# Altium schematic sheet ReboostV2_Phase.SchDoc: Power Electronics
size 420 x 297 mm; DocumentNumber: 2; SheetNumber: 2
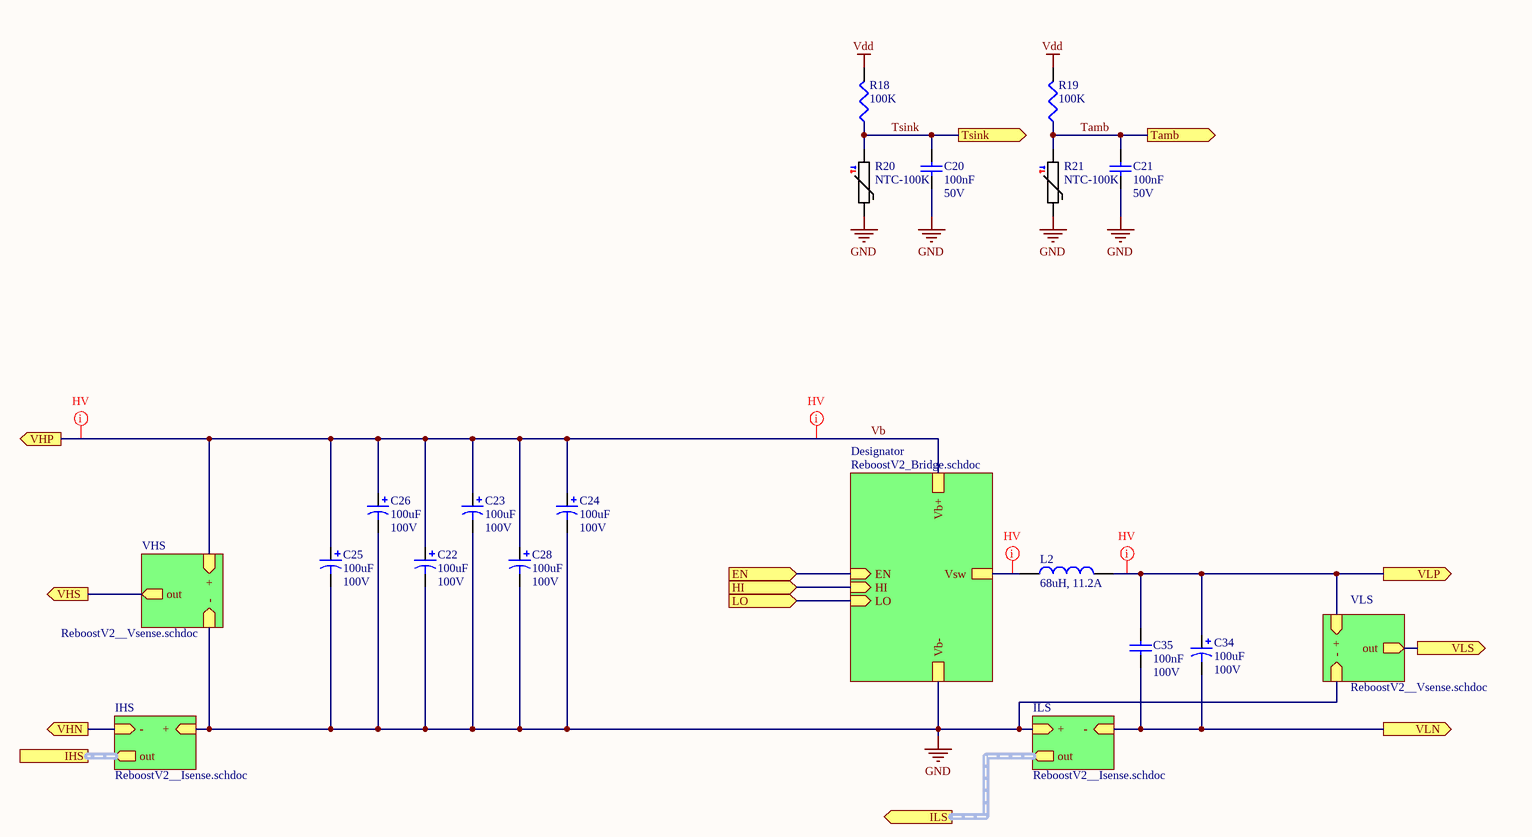
[diagram p0: ReboostV2_Phase.SchDoc]

## Parts
C20  100nF  Voltage Rating: 50V  [C0603]
C21  100nF  Voltage Rating: 50V  [C0603]
C22  100uF  Voltage Rating: 100V  [WCAP-ATUL_10x20x5x0.6]
C23  100uF  Voltage Rating: 100V  [WCAP-ATUL_10x20x5x0.6]
C24  100uF  Voltage Rating: 100V  [WCAP-ATUL_10x20x5x0.6]
C25  100uF  Voltage Rating: 100V  [WCAP-ATUL_10x20x5x0.6]
C26  100uF  Voltage Rating: 100V  [WCAP-ATUL_10x20x5x0.6]
C28  100uF  Voltage Rating: 100V  [WCAP-ATUL_10x20x5x0.6]
C34  100uF  Voltage Rating: 100V  [WCAP-ATUL_10x20x5x0.6]
C35  100nF  Voltage Rating: 100V  [C-0805]
L2  68uH, 11.2A  [WE-HCF_2920]
R18  100K  [0603]
R19  100K  [0603]
R20  NTC-100K  [R0805]
R21  NTC-100K  [R0805]

## Sub-sheets
Designator = ReboostV2_Bridge.schdoc: Vb+, Vsw, Vb-, EN (in), HI (in), LO (in)
IHS = ReboostV2__Isense.schdoc: - (in), + (in), out (out)
ILS = ReboostV2__Isense.schdoc: - (in), + (in), out (out)
VHS = ReboostV2__Vsense.schdoc: + (in), out (out), - (in)
VLS = ReboostV2__Vsense.schdoc: + (in), out (out), - (in)

## Ports
EN (in), HI (in), IHS, ILS (out), LO (in), Tamb (out), Tsink (out), VHN (out), VHP (out), VHS (out), VLN (out), VLP (out), VLS (out)

## Nets
GND: C20.1 C21.1 C22.2 C23.2 C24.2 C25.2 C26.2 C28.2 R20.1 R21.1 ; sheet ILS/+, sheet IHS/+, sheet VLS/-, sheet VHS/-, sheet Designator/Vb-
Vdd: R18.2 R19.2
EN: port EN, sheet Designator/EN
HI: port HI, sheet Designator/HI
LO: port LO, sheet Designator/LO
Tamb: C21.2 R19.1 R21.2 ; port Tamb
Tsink: C20.2 R18.1 R20.2 ; port Tsink
Vb: C22.1 C23.1 C24.1 C25.1 C26.1 C28.1 ; port VHP, sheet VHS/+, sheet Designator/Vb+
VHN: port VHN, sheet IHS/-
VHS: port VHS, sheet VHS/out
VLN: C34.2 C35.1 ; port VLN, sheet ILS/-
VLP: C34.1 C35.2 L2.2 ; port VLP, sheet VLS/+
VLS: port VLS, sheet VLS/out
NetL2_1: L2.1 ; sheet Designator/Vsw

## Buses and harness runs
harness port IHS = sheet IHS/out
harness port ILS = sheet ILS/out

## Layout directives
net class HV: NetL2_1, Vb, VLP

## Notes on the sheet
- PROJECT
- www.tpee.nl <http://www.tpee.nl>
- TITLE
- FILE NAME
- A3
- SIZE
- Author:
- SHEET
- OF

## Library data of the parts
C20 C21 = 100nF/0603/CER/50V: Capacitor, 100nF, 50V, X7R; Capacitance Tolerance: ± 10%; Capacitor Case Style: 0603; Brand Number: MCCA000255; Brand: MULTICOMP; Dielectric Characteristic: X7R; Capacitance: 100nF; Temperature Range: -55°C to +125°C; Price: 0,008; Order Code Supplier: 1759122RL; Supplier: Farnell; Manufacturer: MULTICOMP; Manufacturer Part Number: MCCA000255
C22-C26 C28 C34 = 100uF/ALU/100V: Aluminum Electrolytic Capacitor, 100uF, 100V; Manufacturer: United Chemi-Con; Manufacturer Part Number: EKYB101ELL101MJ20S; Capacitance Tolerance: ± 20%; Capacitor Case Style: Radial Leaded 10 x 20; Dielectric Characteristic: *; Capacitance: 100uF; Temperature Range: -40°C to +85°C; Supplier 1: Mouser; Supplier Part Number 1: 661-EKYB101E101MJ20S
C35 = 100nF/0805/CER/100V: Capacitor, 100nF, 100V, X7R; Capacitance Tolerance: ± 10%; Capacitor Case Style: 0805; Brand Number: C0805C104K1RACTU; Brand: KEMET; Dielectric Characteristic: X7R; Capacitance: 100nF; Temperature Range: -55°C to +125°C; Price: 0,096; Order Code Supplier: 1650862; Supplier: Farnell; Manufacturer: KEMET; Manufacturer Part Number: C0805C104K1RACTU
L2 = 74437429203680: WE-HCF SMT High Current Inductor, size 2920, 68uH, 11.2A, 24.42mOhm; Manufacturer: Wurth Elektronik; Self Resonant Frequency: 5.3MHz; DC Resistance typ.: 22.2mOhm; Saturation Current: 10.7A; ComponentLink1Description: Manufacturer; ComponentLink1URL: http://www.we-online.de; ComponentLink2Description: Datasheet; ComponentLink2URL: https://www.we-online.com/catalog/datasheet/74437429203680.pdf; Mounting Technology: SMT; Operating Temperature: -40 to +125degC; Packaging: Tray and Carton; Published Date: September 2020; DC Resistance max.: 24.42mOhm; Inductance: 68uH; Manufacturer Part Number: 74437429203680; Rated Current: 11.2A; Size: 2920
R18 R19 = 100K/0603/0063W/50V: Resistor, 100K, 1%, 0.063W, 50V, 100PPM, 0603; Brand: VISHAY DRALORIC; Brand Number: CRCW0603100KFKEA; Case Style: 0603; Order Code Supplier: 2122619; Power Rating: 0.063W; Price: 0,039; Resistance: 100K; Supplier: Farnell; Temperature Coefficient: ± 100PPM; Temperature Range: -55°C to +125°C; Voltage Rating: 50V; Manufacturer: VISHAY DRALORIC; Manufacturer Part Number: CRCW0603100KFKEA
R20 R21 = NTCS0805E4104JMT: NTC, 100K, 25°C, 0.5%, 0.210W, 0805; Manufacturer: VISHAY BC COMPONENTS; Case Style: 0805; Order Code Supplier: 1187095; Power Rating: 0.210W; Price: 0,59; Resistance: 100K; Supplier: Farnell; Temperature Range: -55°C to +150°C; Type: NTC-100K; MPN: NTCS0805E4104JMT; Manufacturer Part Number: NTCS0805E4104JMT